# EasyEDA schematic SCH_Placa_Peixebinha_2026-07-04.json
TITLE: Sheet_1; REV: 1.0; Date: 2026-07-03; Sheet: 1/1; Drawn By: projetopeixebinha; Company: Your Company
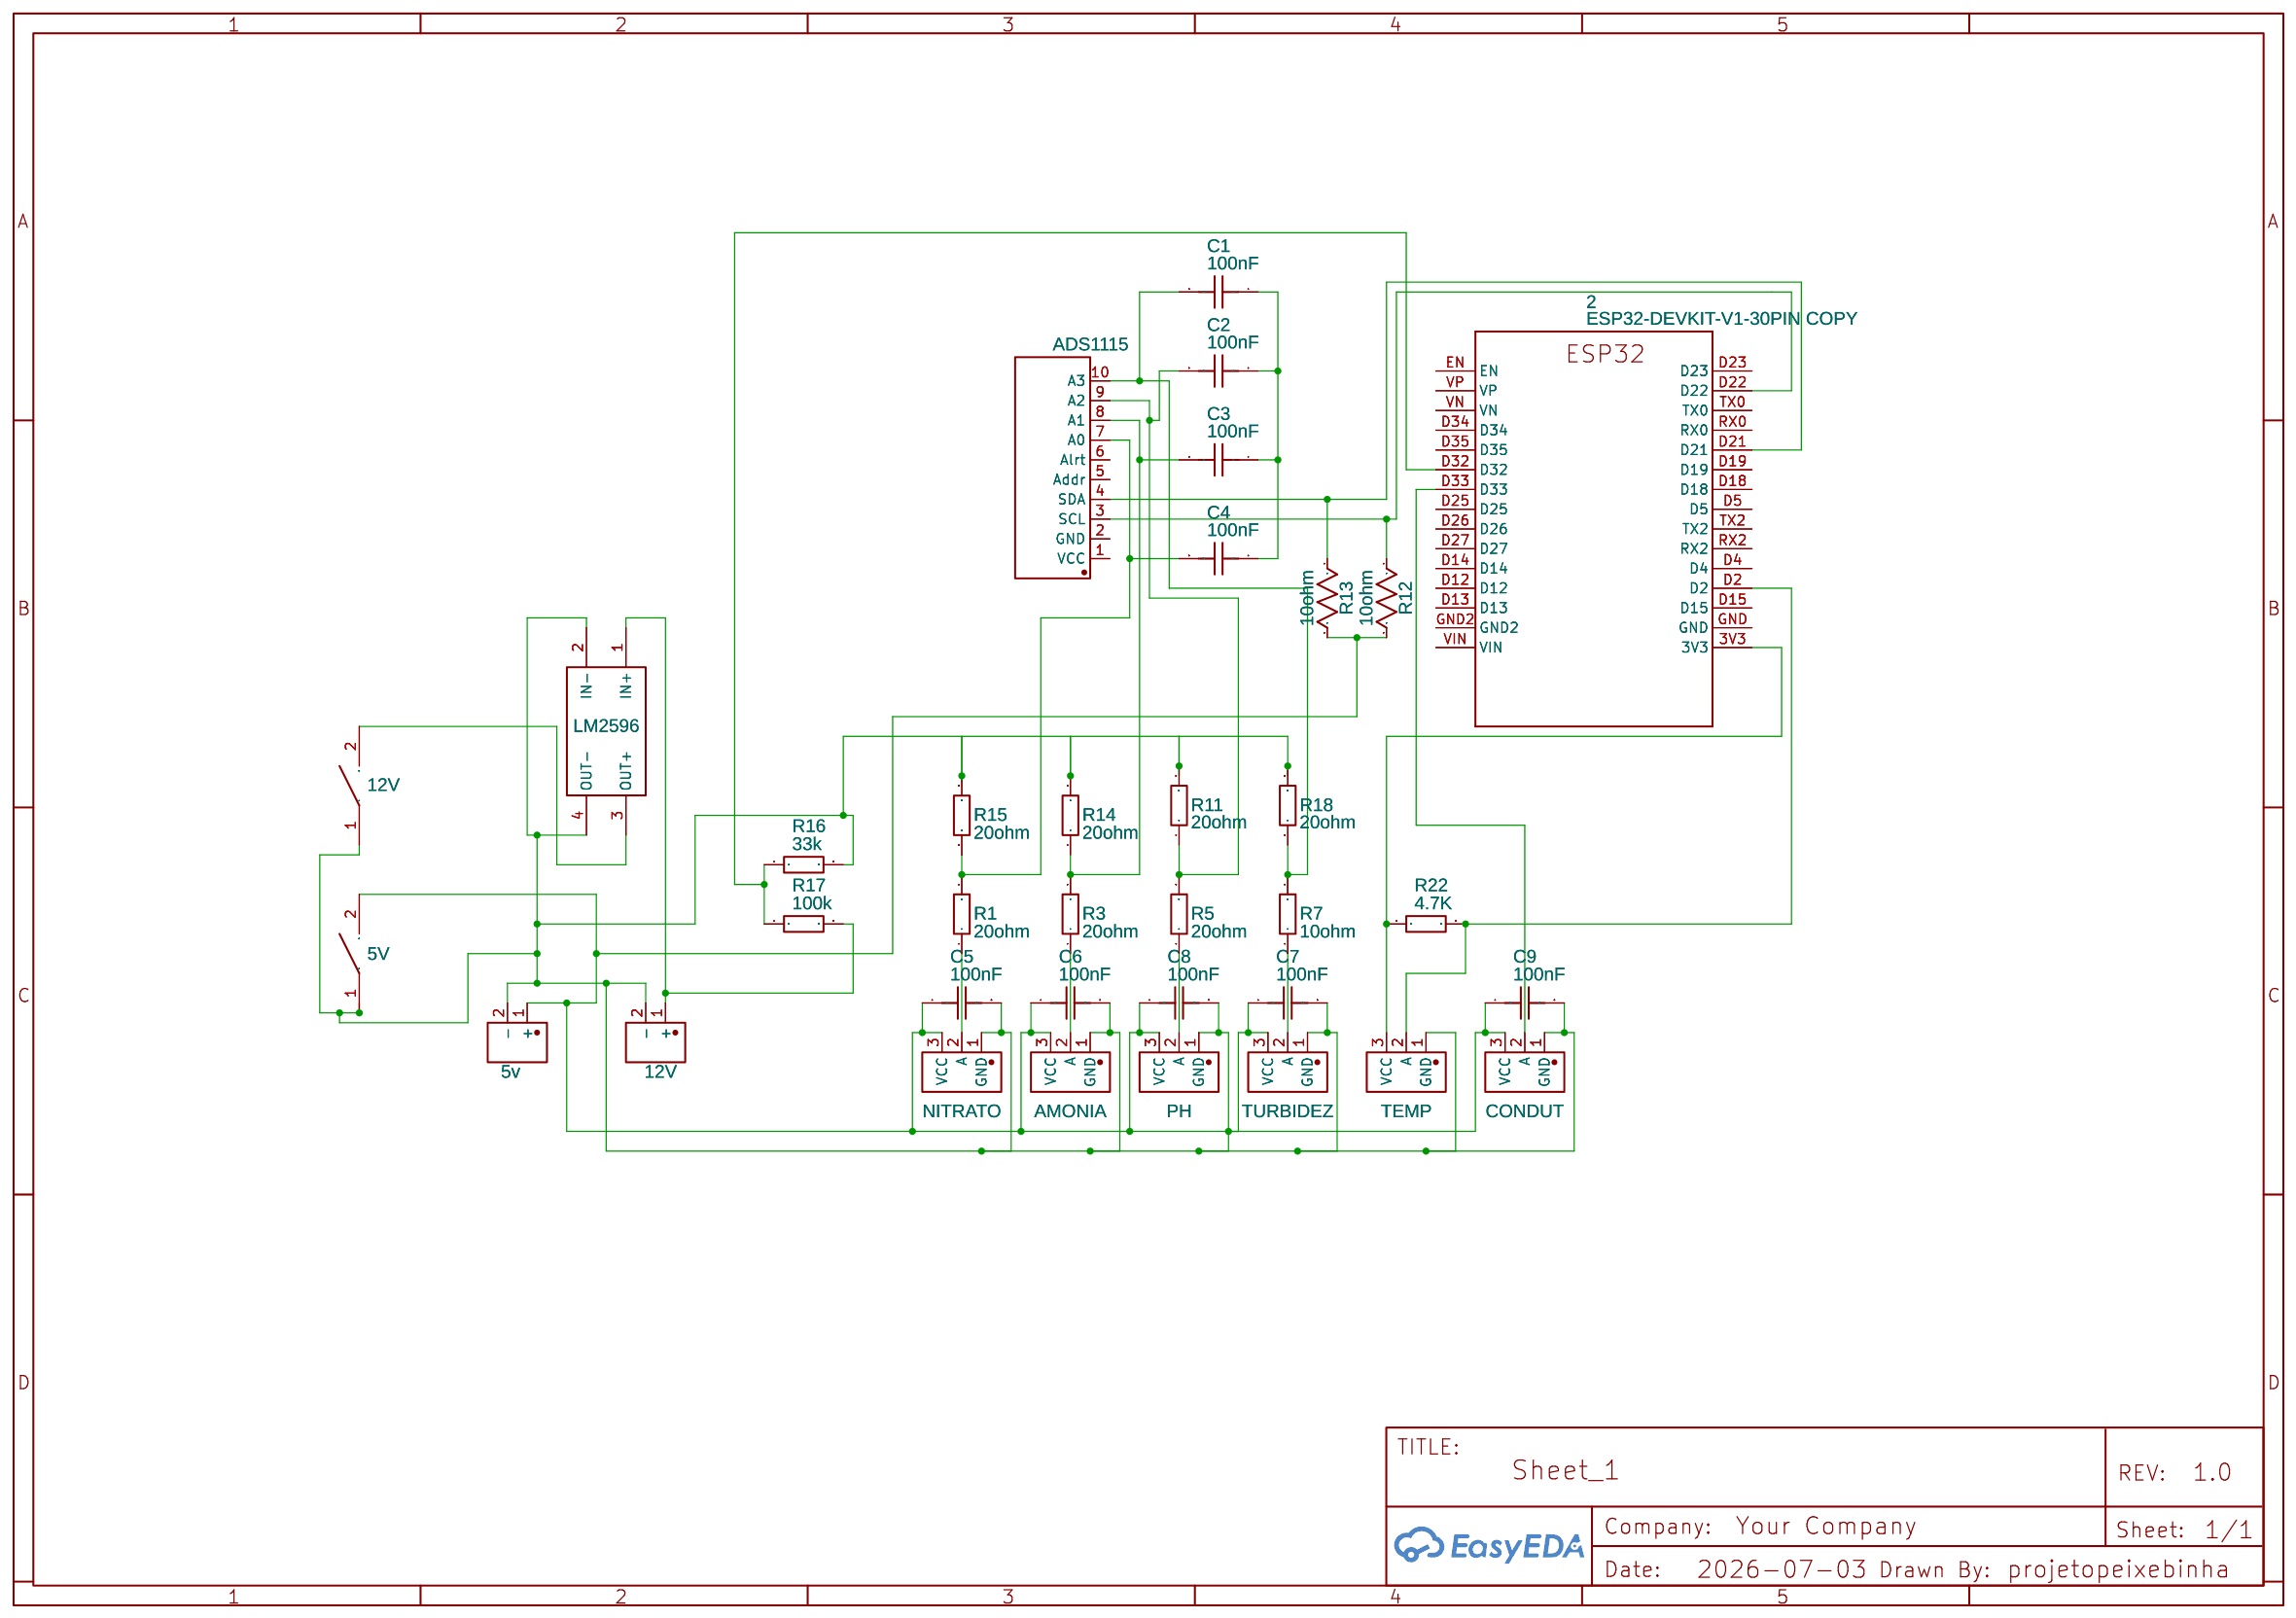
[diagram p0: schematic sheet]

## Parts
2  ESP32-DEVKIT-V1-30PIN COPY  [ESP32-DEVKITV1_ESP32-DEVKITV1]
5V  5V  [DIP_SWITCH_1_WAY]
12V  5V  [DIP_SWITCH_1_WAY]
AMO  AMONIA  [BORNERA 3P]
BORNE1  5v  [BORNERA 2P]
BORNE2  12V  [BORNERA 2P]
C1  100nF  [RAD-0.3]
C2  100nF  [RAD-0.3]
C3  100nF  [RAD-0.3]
C4  100nF  [RAD-0.3]
C5  100nF  [RAD-0.3]
C6  100nF  [RAD-0.3]
C7  100nF  [RAD-0.3]
C8  100nF  [RAD-0.3]
C9  100nF  [RAD-0.3]
COND  CONDUT  [BORNERA 3P]
NIT  NITRATO  [BORNERA 3P]
PH  PH  [BORNERA 3P]
R1  20ohm  [AXIAL-0.6]
R3  20ohm  [AXIAL-0.6]
R5  20ohm  [AXIAL-0.6]
R7  10ohm  [AXIAL-0.6]
R11  20ohm  [AXIAL-0.6]
R12  10ohm  [R0603]
R13  10ohm  [R0603]
R14  20ohm  [AXIAL-0.6]
R15  20ohm  [AXIAL-0.6]
R16  33k  [AXIAL-0.6]
R17  100k  [AXIAL-0.6]
R18  20ohm  [AXIAL-0.6]
R22  4.7K  [AXIAL-0.6]
TEMP  TEMP  [BORNERA 3P]
TURB  TURBIDEZ  [BORNERA 3P]
U1  ADS1115  [ADS1115_F]
U3  LM2596  [LM2596:YAAJ_DCDC_STEPDOWN_LM2596]

## Library data of the parts
2 = ESP32-DEVKIT-V1-30PIN: Contributor: carlos.suarez
5V 12V = DIP_SWITCH_1_WAY: Contributor: ahmed_ashraf_96
AMO COND NIT PH TEMP TURB = BORNERA 3P_SERGIO: Supplier: Bornera; Contributor: Young Jay Villegas Pérez
BORNE1 BORNE2 = BORNERA 2P: Supplier: Bornera; Contributor: youngjay.villegas
C1-C9 = C_RAD-0.3_US: Contributor: LCEDA_Lib
R1 R3 R5 R7 R11 R14-R18 R22 = RESISTOR 1/2 W: Supplier: LCSC; Supplier Part: C348838; Manufacturer: ResistorToday; Manufacturer Part: EWWR0001J20R0T9; Contributor: LCSC
R12 R13 = R_0603_US: Contributor: LCEDA_Lib
U1 = ADS1115_F: Contributor: jccpanadero
U3 = BuckConverters_LM2596_Adj: Servo 5V; Add into BOM: yes; Convert to PCB: yes; Origin Footprint: YAAJ_DCDC_StepDown_LM2596; Contributor: darrell.devanaputra

## Nets
Net-(2-3V3): 2.3V3 R22.1 TEMP.3(VCC)
Net-(2-D2): 2.D2 R22.2 TEMP.2(A)
Net-(2-D21): 2.D21 R13.1 U1.4(SDA)
Net-(2-D22): 2.D22 R12.1 U1.3(SCL)
Net-(2-D32): 2.D32 R16.1 R17.1
Net-(2-D33): 2.D33 COND.2(A)
Net-(5V-1): 5V.1 5V.2 12V.1 AMO.1(GND) AMO.3(VCC) BORNE1.1(+) BORNE1.2(-) BORNE2.2(-) C5.1 C5.2 C6.1 C6.2 C7.1 C7.2 C8.1 C8.2 C9.1 C9.2 COND.1(GND) COND.3(VCC) NIT.1(GND) NIT.3(VCC) PH.1(GND) PH.3(VCC) R11.2 R12.2 R13.2 R14.2 R15.2 R16.2 R18.2 TEMP.1(GND) TURB.1(GND) TURB.3(VCC) U3.2(IN-) U3.4(OUT-)
Net-(12V-2): 12V.2 U3.3(OUT+)
Net-(AMO-2): AMO.2(A) R3.1
Net-(BORNE2-1): BORNE2.1(+) R17.2 U3.1(IN+)
Net-(C1-1): C1.1 C2.1 C3.1 C4.1
Net-(C1-2): C1.2 R7.2 R18.1 U1.10(A3)
Net-(C2-2): C2.2 R5.2 R11.1 U1.9(A2)
Net-(C3-2): C3.2 R3.2 R14.1 U1.8(A1)
Net-(C4-2): C4.2 R1.2 R15.1 U1.7(A0)
Net-(NIT-2): NIT.2(A) R1.1
Net-(PH-2): PH.2(A) R5.1
Net-(R7-1): R7.1 TURB.2(A)

Not connected (* = marked no-connect by the designer): 2 D4 D5 D12 D13 D14 D15 D18 D19 D23 D25 D26 D27 D34 D35 EN GND GND2 RX0 RX2 TX0 TX2 VIN VN VP; U1 1(VCC) 2(GND) 5(Addr) 6(Alrt)
